# Altium schematic sheet Sheet1.SchDoc
size A4
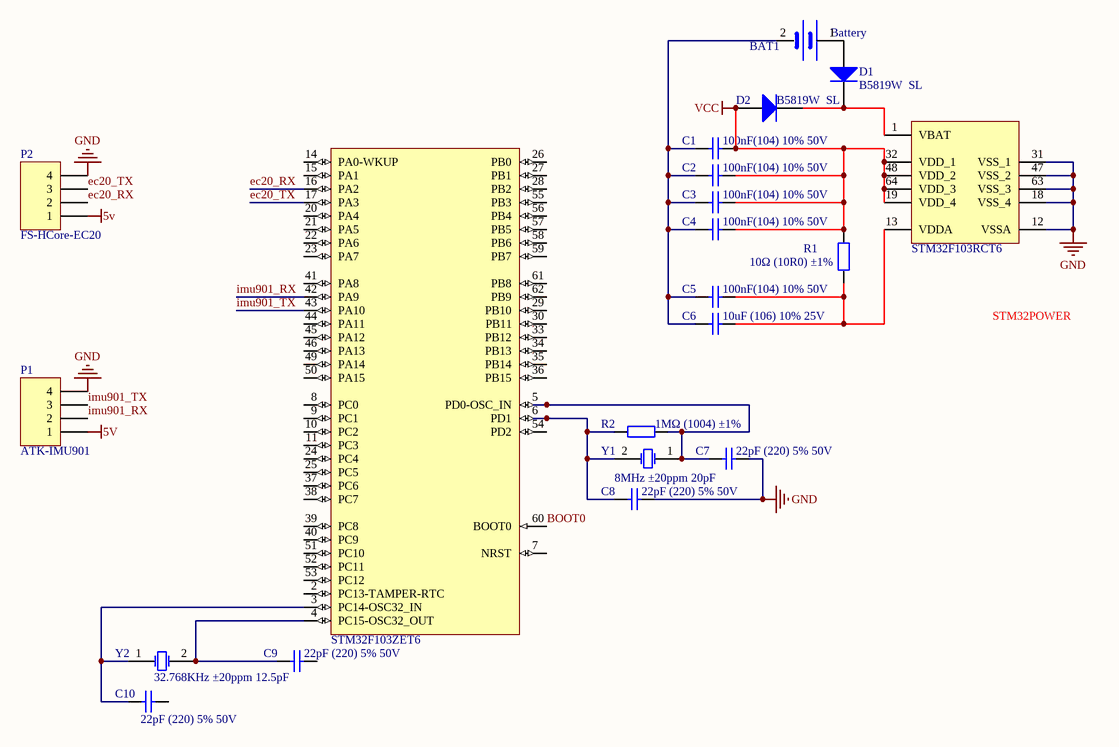
[diagram p0: Sheet1.SchDoc]

## Parts
?  STM32F103ZET6  [LQFP-64_10x10x05P]  (part A of 2)
BAT1  Battery  [BATTERY]
C1  100nF(104) 10% 50V  [0805_C]
C2  100nF(104) 10% 50V  [0805_C]
C3  100nF(104) 10% 50V  [0805_C]
C4  100nF(104) 10% 50V  [0805_C]
C5  100nF(104) 10% 50V  [0805_C]
C6  10uF (106) 10% 25V  [0805_C]
C7  22pF (220) 5% 50V  [0805_C]
C8  22pF (220) 5% 50V  [0805_C]
C9  22pF (220) 5% 50V  [0805_C]
C10  22pF (220) 5% 50V  [0805_C]
D1  B5819W  SL  [SOD-123]
D2  B5819W  SL  [SOD-123]
P1  ATK-IMU901  [HDR1X4]
P2  FS-HCore-EC20  [HDR1X4]
R1  10Ω (10R0) ±1%  [0805_R]
R2  1MΩ (1004) ±1%  [0805_R]
U1  STM32F103RCT6  [LQFP-64_10x10x05P]  (part B of 2)
Y1  8MHz ±20ppm 20pF  [SMD-5032_2P]
Y2  32.768KHz ±20ppm 12.5pF  [SMD-3215_2P FC - 135]

## Nets
5V: P1.1 P2.1
GND: C7.2 C8.2 P1.4 P2.4 U1.12(VSSA) U1.18(VSS_4) U1.31(VSS_1) U1.47(VSS_2) U1.63(VSS_3)
VCC: C1.1 C2.1 C3.1 C4.1 D2.1(A) R1.2 U1.19(VDD_4) U1.32(VDD_1) U1.48(VDD_2) U1.64(VDD_3)
BOOT0: ?.60(BOOT0)
ec20_RX: ?.16(PA2) P2.2
ec20_TX: ?.17(PA3) P2.3
imu901_RX: ?.42(PA9) P1.2
imu901_TX: ?.43(PA10) P1.3
Net?_3: ?.3(PC14-OSC32_IN) C10.2 Y2.1(OSC1)
Net?_4: ?.4(PC15-OSC32_OUT) C9.2 Y2.2(OSC2)
Net?_5: ?.5(PD0-OSC_IN) C7.1 R2.1 Y1.1(OSC1)
Net?_6: ?.6(PD1) C8.1 R2.2 Y1.2(OSC2)
NetBAT1_1: BAT1.1(VCC) D1.1(A)
NetBAT1_2: BAT1.2(GND) C1.2 C2.2 C3.2 C4.2 C5.1 C6.2
NetC5_2: C5.2 C6.1 R1.1 U1.13(VDDA)
NetD1_2: D1.2(K) D2.2(K) U1.1(VBAT)

Not connected (* = marked no-connect by the designer): ? 2(PC13-TAMPER-RTC) 7(NRST) 8(PC0) 9(PC1) 10(PC2) 11(PC3) 14(PA0-WKUP) 15(PA1) 20(PA4) 21(PA5) 22(PA6) 23(PA7) 24(PC4) 25(PC5) 26(PB0) 27(PB1) 28(PB2) 29(PB10) 30(PB11) 33(PB12) 34(PB13) 35(PB14) 36(PB15) 37(PC6) 38(PC7) 39(PC8) 40(PC9) 41(PA8) 44(PA11) 45(PA12) 46(PA13) 49(PA14) 50(PA15) 51(PC10) 52(PC11) 53(PC12) 54(PD2) 55(PB3) 56(PB4) 57(PB5) 58(PB6) 59(PB7) 61(PB8) 62(PB9); C9 1; C10 1

## Notes on the sheet
- STM32POWER

## Library data of the parts
? U1 = STM32F103RCT6: ARM; ComponentLink1Description: 供应商链接; ComponentLink1URL: http://www.szlcsc.com/product/details_8815.html; Package: LQFP-64_10x10x05P; Supplier: LC; SuppliersPartNumber: C8323
C1-C5 = 0805 100nF(104) 10% 50V: 贴片电容; ComponentLink1Description: 供应商链接; ComponentLink1URL: http://www.szlcsc.com/product/details_50686.html; Package: 0805; Supplier: LC; SuppliersPartNumber: C49678
C6 = 0805 10uF (106) 10% 25V: 贴片电容; ComponentLink1Description: 供应商链接; ComponentLink1URL: http://www.szlcsc.com/product/details_16532.html; Package: 0805; Supplier: LC; SuppliersPartNumber: C15850
C7-C10 = 0805 22pF (220) 5% 50V: 贴片电容; ComponentLink1Description: 供应商链接; ComponentLink1URL: http://www.szlcsc.com/product/details_2156.html; Package: 0805; Supplier: LC; SuppliersPartNumber: C1804
D1 D2 = SOD-123 B5819W  SL: 肖特基二极管; ComponentLink1Description: 供应商链接; ComponentLink1URL: http://www.szlcsc.com/product/details_9093.html; Package: SOD-123; Supplier: LC; SuppliersPartNumber: C8598
P1 P2 = Header 4: Header, 4-Pin; LatestRevisionDate: 17-Jul-2002; LatestRevisionNote: Re-released for DXP Platform.; Publisher: Altium Limited
R1 = 0805 10Ω (10R0) 1%: 贴片电阻; ComponentLink1Description: 供应商链接; ComponentLink1URL: http://www.szlcsc.com/product/details_18103.html; Package: 0805; Supplier: LC; SuppliersPartNumber: C17415
R2 = 0805 1MΩ (1004) 1%: 贴片电阻; ComponentLink1Description: 供应商链接; ComponentLink1URL: http://www.szlcsc.com/product/details_18202.html; Package: 0805; Supplier: LC; SuppliersPartNumber: C17514
Y1 = SMD-5032_2P 8MHz 20ppm 20pF: 贴片晶振; ComponentLink1Description: 供应商链接; ComponentLink1URL: http://www.szlcsc.com/product/details_117214.html; Package: SMD-5032_2P; Supplier: LC; SuppliersPartNumber: C115962
Y2 = SMD-3215_2P 32.768KHz 20ppm 12.5pF: 贴片晶振; ComponentLink1Description: 供应商链接; ComponentLink1URL: http://www.szlcsc.com/product/details_33310.html; Package: SMD-3215_2P; Supplier: LC; SuppliersPartNumber: C32346